# Altium schematic sheet Project_Node_Sensors.SchDoc: Principal Node_Sensor Schematic
size A; Date: 10/08/2024; Author: Prudhvi Kondapalli; CompanyName: CU Boulder; DrawnBy: Project_Vega_Team; Engineer: Prudhvi Kondapalli; DocumentNumber: 1; Revision: 1; SheetNumber: 5; SheetTotal: 7
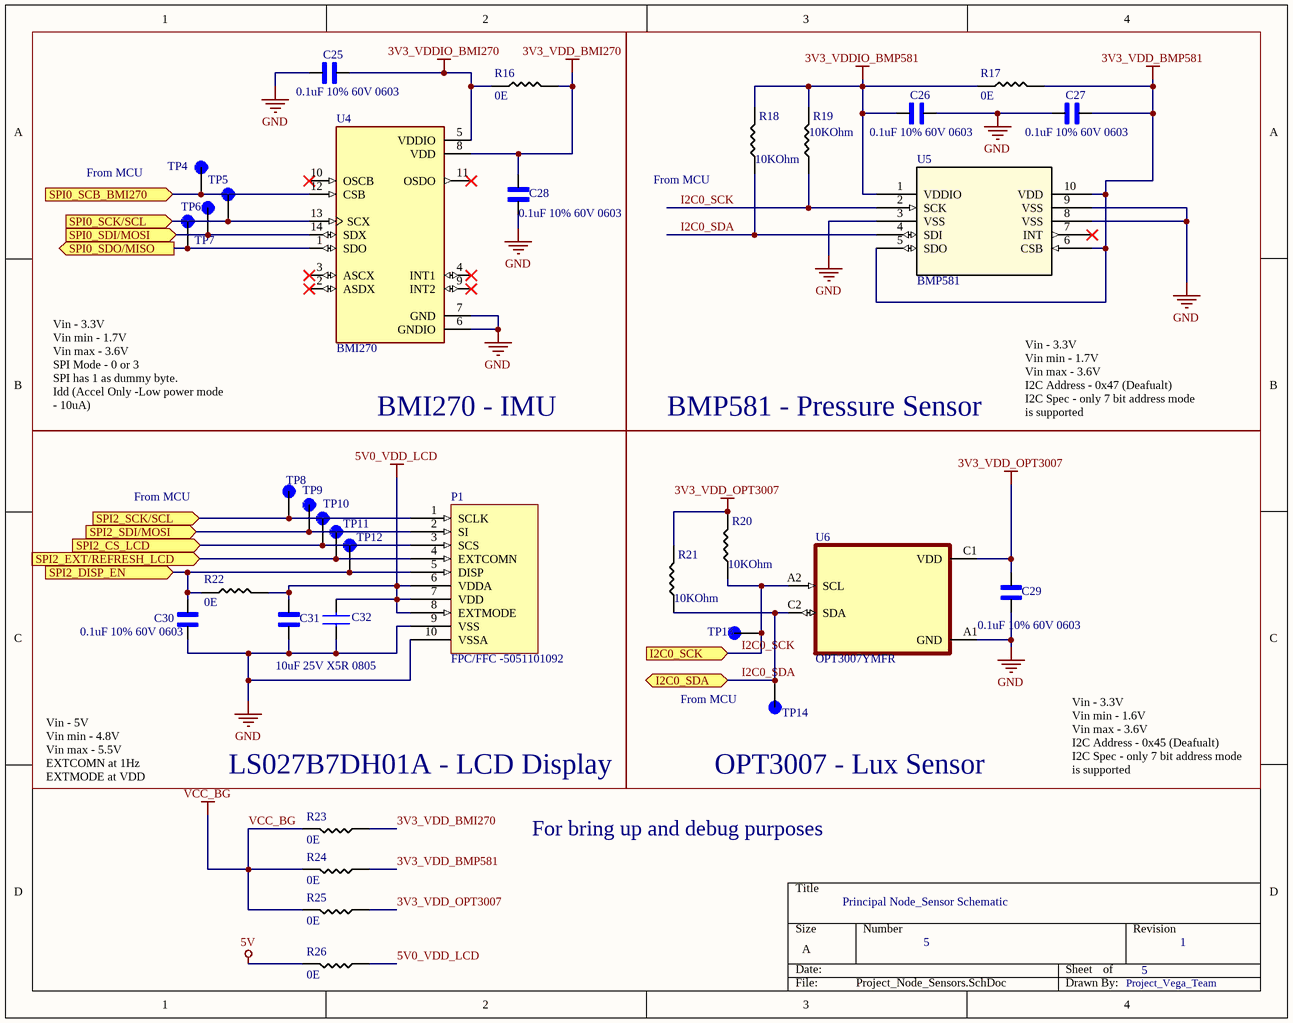
[diagram p0: Project_Node_Sensors.SchDoc]

## Parts
C25  0.1uF 10% 60V 0603  [CAPC1608X90]
C26  0.1uF 10% 60V 0603  [CAPC1608X90]
C27  0.1uF 10% 60V 0603  [CAPC1608X90]
C28  0.1uF 10% 60V 0603  [CAPC1608X90]
C29  0.1uF 10% 60V 0603  [CAPC1608X90]
C30  0.1uF 10% 60V 0603  [CAPC1608X90]
C31  0.1uF 10% 60V 0603  [CAPC1608X90]  (value not drawn)
C32  10uF 25V X5R 0805  [CAP_0805_2mmX1.25mm]
P1  FPC/FFC -5051101092  [CON_5051101092_MOL]
R16  value 0E  [1206_Passive_Resitor]  (hidden comment: 10k)
R17  value 0E  [1206_Passive_Resitor]  (hidden comment: 10k)
R18  value 10KOhm  [1206_Passive_Resitor]  (hidden comment: 10k)
R19  value 10KOhm  [1206_Passive_Resitor]  (hidden comment: 10k)
R20  value 10KOhm  [1206_Passive_Resitor]  (hidden comment: 10k)
R21  value 10KOhm  [1206_Passive_Resitor]  (hidden comment: 10k)
R22  value 0E  [1206_Passive_Resitor]  (hidden comment: 10k)
R23  value 0E  [1206_Passive_Resitor]  (hidden comment: 10k)
R24  value 0E  [1206_Passive_Resitor]  (hidden comment: 10k)
R25  value 0E  [1206_Passive_Resitor]  (hidden comment: 10k)
R26  value 0E  [1206_Passive_Resitor]  (hidden comment: 10k)
TP4  Test_point  [TP]  (value not drawn)
TP5  Test_point  [TP]  (value not drawn)
TP6  Test_point  [TP]  (value not drawn)
TP7  Test_point  [TP]  (value not drawn)
TP8  Test_point  [TP]  (value not drawn)
TP9  Test_point  [TP]  (value not drawn)
TP10  Test_point  [TP]  (value not drawn)
TP11  Test_point  [TP]  (value not drawn)
TP12  Test_point  [TP]  (value not drawn)
TP13  Test_point  [TP]  (value not drawn)
TP14  Test_point  [TP]  (value not drawn)
U4  BMI270  [XDCR_BMI270]
U5  BMP581  [QFN10_BMP581_BOS-M]
U6  OPT3007YMFR  [BGA6N60X35P2X3_85X94X22N]

## Blocks framed on the sheet
BMI270 - IMU: C25 C28 R16 TP4-TP7 U4
BMP581 - Pressure Sensor: C26 C27 R17-R19 U5

## Ports
I2C0_SCK (in, see Principal_Node[2C]), I2C0_SDA (bidir, see Principal_Node[2C]), SPI0_SCB_BMI270 (in, see Principal_Node[2D]), SPI0_SCK/SCL (in, see Principal_Node[2D]), SPI0_SDI/MOSI (in, see Principal_Node[2D]), SPI0_SDO/MISO (out, see Principal_Node[2D]), SPI2_CS_LCD (in, see Principal_Node[2D]), SPI2_DISP_EN (in, see Principal_Node[2C]), SPI2_EXT/REFRESH_LCD (in, see Principal_Node[2C]), SPI2_SCK/SCL (in, see Principal_Node[2D]), SPI2_SDI/MOSI (in, see Principal_Node[2D])

## Nets
3V3_VDD_BMI270: C28.1 R16.2 R23.1 U4.8(VDD)
3V3_VDD_BMP581: C27.2 R17.2 R24.1 U5.5(SDO) U5.6(CSB) U5.10(VDD)
3V3_VDD_OPT3007: C29.2 R20.2 R21.2 R25.1 U6.C1(VDD)
3V3_VDDIO_BMI270: C25.2 R16.1 U4.5(VDDIO)
3V3_VDDIO_BMP581: C26.1 R17.1 R18.2 R19.2 U5.1(VDDIO)
5V: R26.2
5V0_VDD_LCD: C31.2 C32.1 P1.6(VDDA) P1.7(VDD) P1.8(EXTMODE) R22.2 R26.1
GND: C25.1 C26.2 C27.1 C28.2 C29.1 C30.1 C31.1 C32.2 P1.9(VSS) P1.10(VSSA) U4.6(GNDIO) U4.7(GND) U5.3(VSS) U5.8(VSS) U5.9(VSS) U6.A1(GND)
VCC_BG: R23.2 R24.2 R25.2
I2C0_SCK: R19.1 R20.1 TP13.TP U5.2(SCK) U6.A2(SCL) ; port I2C0_SCK
I2C0_SDA: R18.1 R21.1 TP14.TP U5.4(SDI) U6.C2(SDA) ; port I2C0_SDA
SPI0_SCB_BMI270: TP4.TP U4.12(CSB) ; port SPI0_SCB_BMI270
SPI0_SCK/SCL: TP5.TP U4.13(SCX) ; port SPI0_SCK/SCL
SPI0_SDI/MOSI: TP6.TP U4.14(SDX) ; port SPI0_SDI/MOSI
SPI0_SDO/MISO: TP7.TP U4.1(SDO) ; port SPI0_SDO/MISO
SPI2_CS_LCD: P1.3(SCS) TP10.TP ; port SPI2_CS_LCD
SPI2_DISP_EN: C30.2 P1.5(DISP) R22.1 TP12.TP ; port SPI2_DISP_EN
SPI2_EXT/REFRESH_LCD: P1.4(EXTCOMN) TP11.TP ; port SPI2_EXT/REFRESH_LCD
SPI2_SCK/SCL: P1.1(SCLK) TP8.TP ; port SPI2_SCK/SCL
SPI2_SDI/MOSI: P1.2(SI) TP9.TP ; port SPI2_SDI/MOSI

Not connected (* = marked no-connect by the designer): U4 2(ASDX)* 3(ASCX)* 4(INT1)* 9(INT2)* 10(OSCB)* 11(OSDO)*; U5 7(INT)*

## Notes on the sheet
- From MCU
- Vin - 3.3V
  Vin min - 1.7V
  Vin max - 3.6V
  SPI Mode - 0 or 3
  SPI has 1 as dummy byte.
  Idd (Accel Only -Low power mode - 10uA)
- Vin - 3.3V
  Vin min - 1.7V
  Vin max - 3.6V
  I2C Address - 0x47 (Deafualt)
  I2C Spec - only 7 bit address mode is supported
- Vin - 5V
  Vin min - 4.8V
  Vin max - 5.5V
  EXTCOMN at 1Hz
  EXTMODE at VDD
- (near R23) LS027B7DH01A - LCD Display
- (near TP14) OPT3007 - Lux Sensor
- Vin - 3.3V
  Vin min - 1.6V
  Vin max - 3.6V
  I2C Address - 0x45 (Deafualt)
  I2C Spec - only 7 bit address mode is supported
- For bring up and debug purposes

## Library data of the parts
C25-C31 = CC0603KRX7R9BB104: 0.1 ÂµF Â±10% 50V Ceramic Capacitor X7R 0603 (1608 Metric); MF: Yageo; SnapEDA_Link: https://www.snapeda.com/parts/CC0603KRX7R9BB104/Yageo/view-part/?ref=snap; Package: 0603 Yageo; Value: *; MP: CC0603KRX7R9BB104; Check_prices: https://www.snapeda.com/parts/CC0603KRX7R9BB104/Yageo/view-part/?ref=eda
C32 = GRM21BR61E106KA73K: Multilayer Ceramic Capacitor, 10 uF, 25 V, +/- 10%, X5R, 0805 [2012 Metric]; Manufacturer: Murata; Supplier: Digikey; Supplier Part Number: 490-16824-1-ND; Manufacturer Part Number: GRM21BR61E106KA73K; RoHS: Yes; Category: Ceramic Capacitors; Stock: 274241; Pricing: 1=0.21, 10=0.133, 50=0.0838, 100=0.0671, 500=0.04848, 1000=0.04288, 2500=0.04102, 5000=0.03729, 10000=0.03542, 20000=0.03356, 30000=0.03169, 50000=0.02983, 100000=0.02517, 250000=0.0233 (USD); Mounting Technology: Surface Mount; Case/Package: 0805; Weight: 0.000335oz; Case Code (Imperial): 0805; Case Code (Metric): 2012; Material: Ceramic; Min Operating Temperature: -55°C; Max Operating Temperature: 85°C; Packaging: Tape and Reel; Value: 10uF; Voltage Rating: 25V; Tolerance: 10%; Package Quantity: 10000; Dielectric: X5R; Voltage Rating (DC): 25V; Series: GRM; Length: 0.079inch; Width: 0.049inch; Height: 1.4mm; Thickness: 0.055inch; RoHS Compliant: Yes; ComponentLink1URL: http://www.mouser.com/ds/2/281/c02e-2905.pdf?src-supplier=Mouser; ComponentLink1Description: http://www.mouser.com/ds/2/281/c02e-2905.pdf?src-supplier=Mouser; ComponentLink2URL: http://search.murata.co.jp/Ceramy/image/img/A01X/G101/ENG/GRM21BR61E106KA73-01.pdf?src-supplier=Digikey; ComponentLink2Description: http://search.murata.co.jp/Ceramy/image/img/A01X/G101/ENG/GRM21BR61E106KA73-01.pdf?src-supplier=Digikey; ComponentLink3URL: https://search.murata.co.jp/Ceramy/image/img/A01X/G101/ENG/GRM21BR61E106KA73-01.pdf?src-supplier=Digikey; ComponentLink3Description: https://search.murata.co.jp/Ceramy/image/img/A01X/G101/ENG/GRM21BR61E106KA73-01.pdf?src-supplier=Digikey; ComponentLink4URL: https://datasheet.octopart.com/GRM21BR61E106KA73K-Murata-datasheet-149523495.pdf?src-supplier=Newark; ComponentLink4Description: https://datasheet.octopart.com/GRM21BR61E106KA73K-Murata-datasheet-149523495.pdf?src-supplier=Newark; ComponentLink5URL: https://datasheet.octopart.com/GRM21BR61E106KA73K-Murata-datasheet-99353849.pdf?src-supplier=Future+Electronics; ComponentLink5Description: https://datasheet.octopart.com/GRM21BR61E106KA73K-Murata-datasheet-99353849.pdf?src-supplier=Future+Electronics; ComponentLink6URL: https://datasheet.octopart.com/GRM21BR61E106KA73K-Murata-datasheet-165579666.pdf?src-supplier=TME; ComponentLink6Description: https://datasheet.octopart.com/GRM21BR61E106KA73K-Murata-datasheet-165579666.pdf?src-supplier=TME
P1 = 5051101092: 10 Position FFC, FPC Connector Contacts, Bottom 0.020" (0.50mm) Surface Mount, Right Angle
R16-R26 = R_10KOhm_1206: 10 kOhms ±5% 0.25W, 1/4W Chip Resistor 1206 (3216 Metric) Automotive AEC-Q200 Thick Film; MFR Part #: RMCF1206FT10K0; Digikey Link: https://www.digikey.com/en/products/detail/stackpole-electronics-inc/RMCF1206FT10K0/1759669; LCSC Part#: C17902; Type: Basic
TP4-TP14 = Test_point: SMT Test Point- Mininature-1000 pc Reels; MP: 5019; MF: Keystone Electronics; Value: *; Availability: In Stock; Purchase-URL: https://pricing.snapeda.com/search/part/5019/?ref=eda; Package: None; Price: None
U4 = BMI270: Accelerometer, Gyroscope, 6 Axis Sensor IÂ²C, SPI Output; MF: Bosch Sensortec; Digi-Key_Part_Number: 828-1091-2-ND; Check_prices: https://www.snapeda.com/parts/BMI270/Bosch+Sensortec/view-part/?ref=eda; MP: BMI270; Package: LGA-14 Bosch Sensortec; SnapEDA_Link: https://www.snapeda.com/parts/BMI270/Bosch+Sensortec/view-part/?ref=snap; Value: *; Purchase-URL: https://pricing.snapeda.com/search/part/BMI270/?ref=eda
U5 = BMP581: No Description Available; Mfr_Name: Bosch Sensortec; RefDes: RefDes; Type: Type
U6 = OPT3007YMFR: Ultra-thin ambient light sensor (ALS) with fixed I2C address 6-PICOSTAR -40 to 85; MF: Texas Instruments; Value: *; MP: OPT3007YMFR; Package: PICOSTAR-6 Texas Instruments; Check_prices: https://www.snapeda.com/parts/OPT3007YMFR/Texas+Instruments/view-part/?ref=eda; Price: None; Purchase-URL: https://pricing.snapeda.com/search/part/OPT3007YMFR/?ref=eda; SnapEDA_Link: https://www.snapeda.com/parts/OPT3007YMFR/Texas+Instruments/view-part/?ref=snap; Availability: In Stock